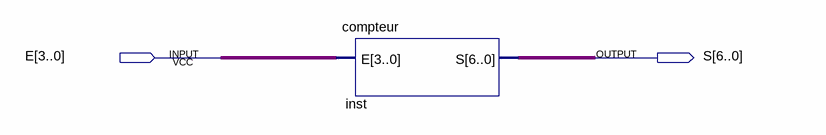
[diagram p0: schematic sheet]
// Quartus schematic compteur_SCHEME.bdf as structural Verilog: 1 symbols, 2 pins
module compteur_SCHEME (
  input  [3:0] E,
  output [6:0] S
);

  compteur inst (.E(E), .S(S));
endmodule
